# Altium schematic sheet TopSheet.SchDoc
size A2; SheetNumber: 1; SheetTotal: 16
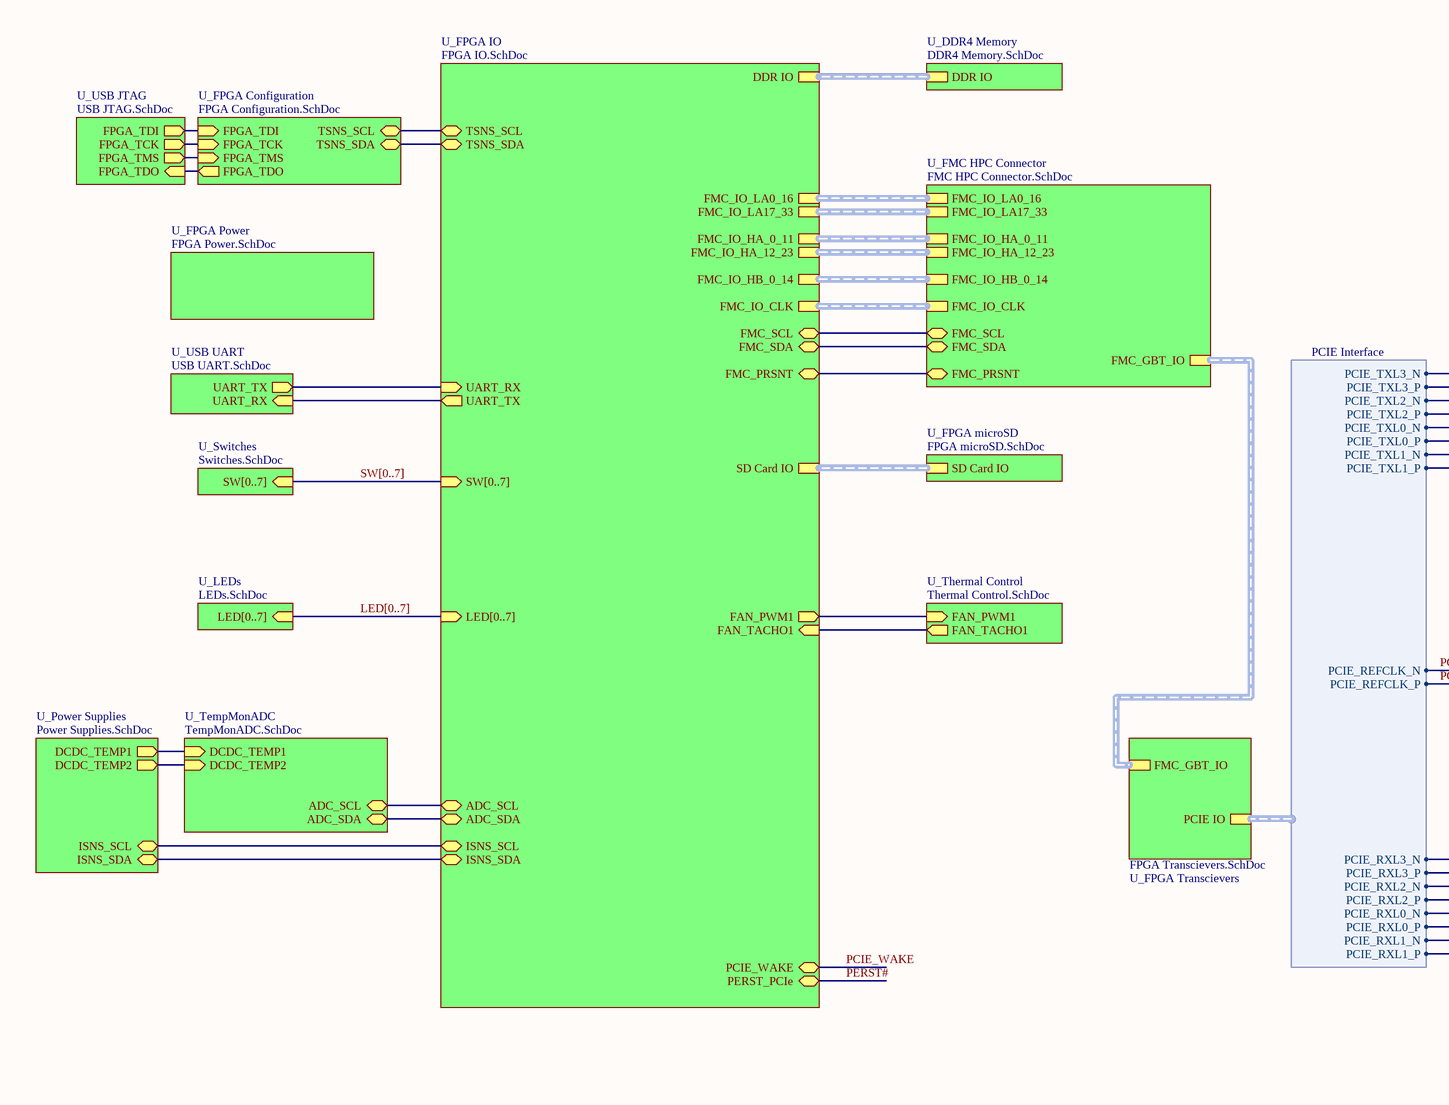
[diagram p0: TopSheet.SchDoc, left]
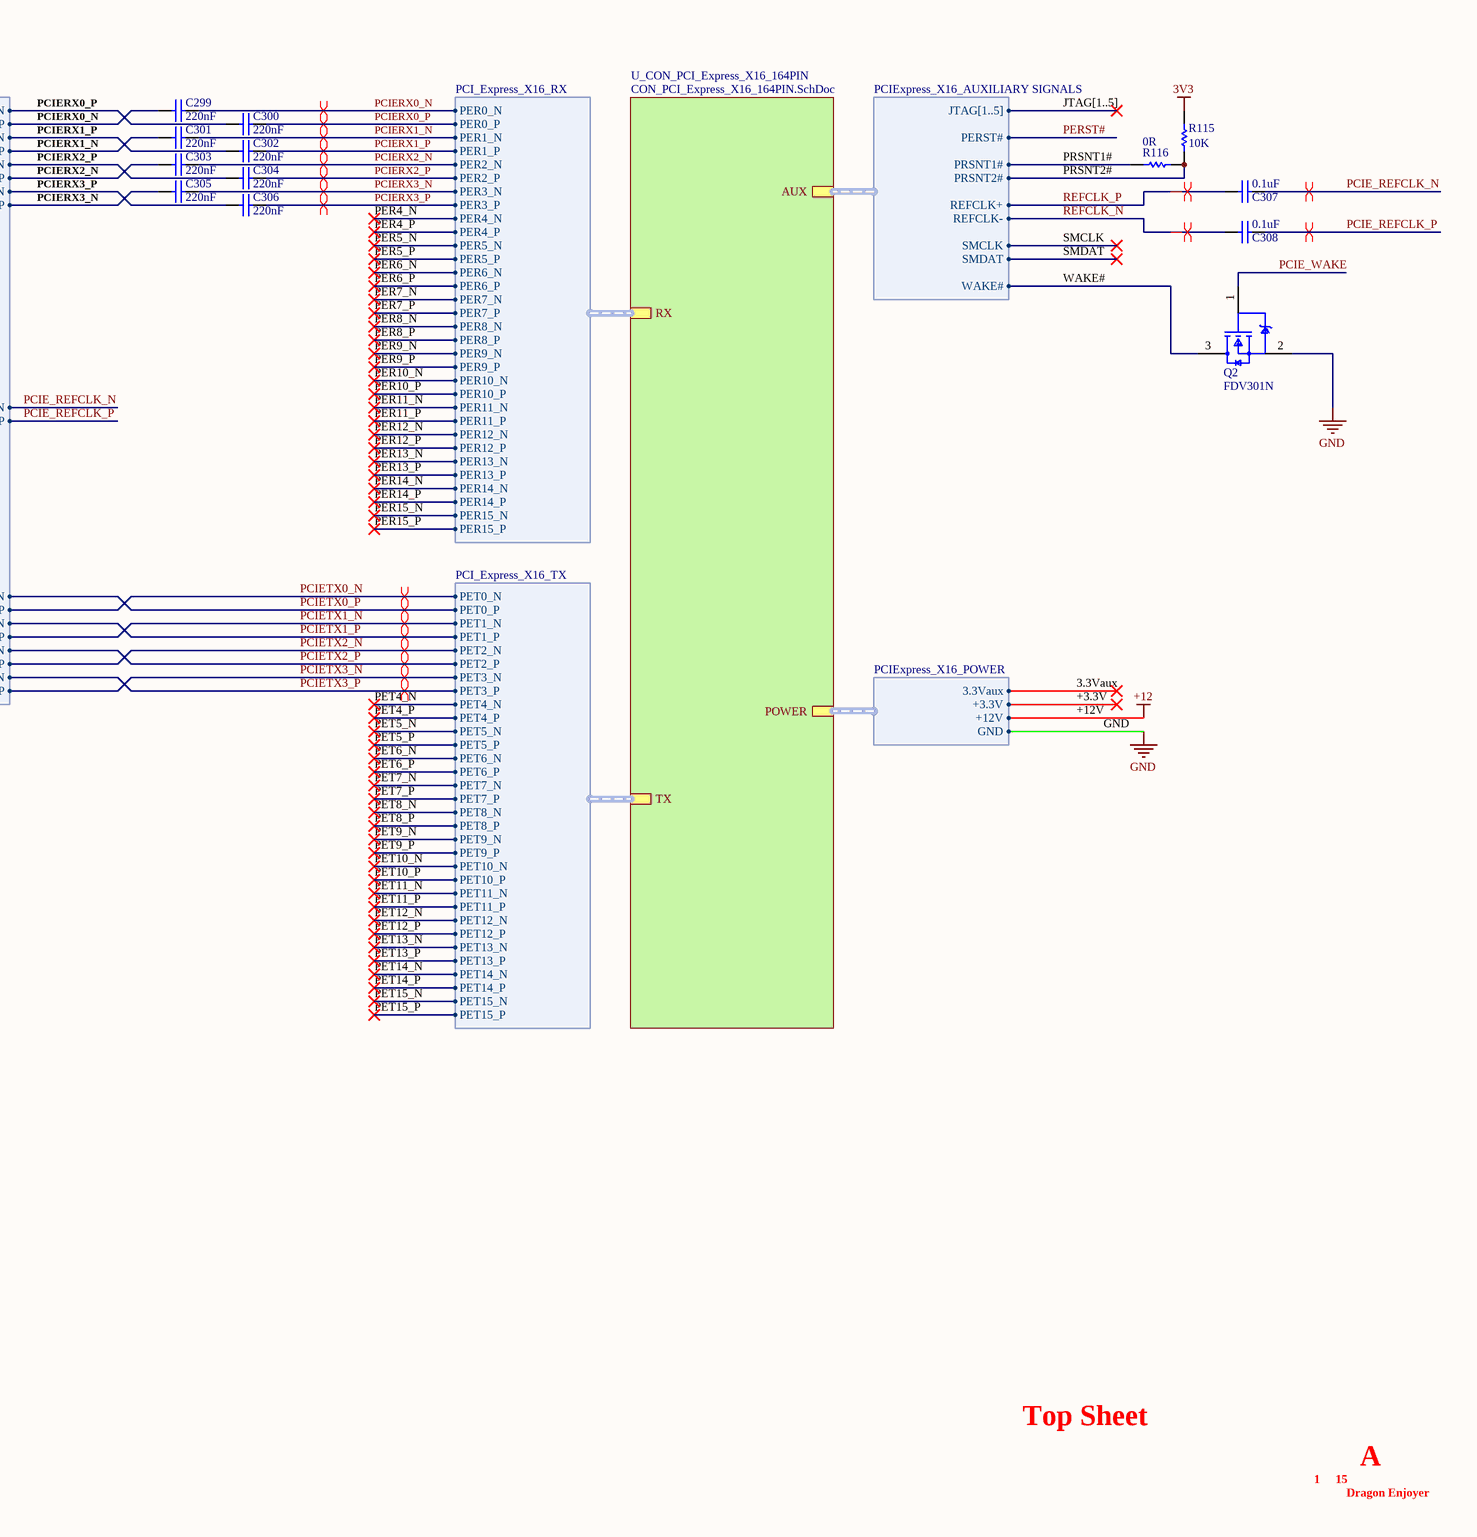
[diagram p1: TopSheet.SchDoc, right]

## Parts
C299  value 220nF  [CAPC1005X56X25LL10T15]  (hidden comment: 04026D224MAT2A)
C300  value 220nF  [CAPC1005X56X25LL10T15]  (hidden comment: 04026D224MAT2A)
C301  value 220nF  [CAPC1005X56X25LL10T15]  (hidden comment: 04026D224MAT2A)
C302  value 220nF  [CAPC1005X56X25LL10T15]  (hidden comment: 04026D224MAT2A)
C303  value 220nF  [CAPC1005X56X25LL10T15]  (hidden comment: 04026D224MAT2A)
C304  value 220nF  [CAPC1005X56X25LL10T15]  (hidden comment: 04026D224MAT2A)
C305  value 220nF  [CAPC1005X56X25LL10T15]  (hidden comment: 04026D224MAT2A)
C306  value 220nF  [CAPC1005X56X25LL10T15]  (hidden comment: 04026D224MAT2A)
C307  value 0.1uF  [CAPC1005X56X25LL10T15]  (hidden comment: 04026D104KAT2A)
C308  value 0.1uF  [CAPC1005X56X25LL10T15]  (hidden comment: 04026D104KAT2A)
Q2  FDV301N  [FP-318-08-MFG]
R115  value 10K  [RESC1609X50X30NL8T20]  (hidden comment: CRCW060310K0FKEA)
R116  value 0R  [RESC1005X40X25ML05T10]  (hidden comment: CRCW04020000Z0EDHP)

## Sub-sheets
U_CON_PCI_Express_X16_164PIN = CON_PCI_Express_X16_164PIN.SchDoc: POWER (harness PCIExpress_X16_POWER), AUX (harness PCIExpress_X16_AUXILIARY SIGNALS), TX (harness PCI_Express_X16_TX), RX (harness PCI_Express_X16_RX)
U_DDR4 Memory = DDR4 Memory.SchDoc: DDR IO (harness DDR IO)
U_FMC HPC Connector = FMC HPC Connector.SchDoc: FMC_GBT_IO (harness FMC_GBT_IO), FMC_IO_LA0_16 (harness FMC_IO_LA0_16), FMC_IO_LA17_33 (harness FMC_IO_LA17_33), FMC_IO_HA_0_11 (harness FMC_IO_HA_0_11), FMC_IO_HA_12_23 (harness FMC_IO_HA_12_23), FMC_SCL (bidir), FMC_SDA (bidir), FMC_PRSNT (bidir), FMC_IO_CLK (harness FMC_IO_CLK), FMC_IO_HB_0_14 (harness FMC_IO_HB_0_14)
U_FPGA Configuration = FPGA Configuration.SchDoc: FPGA_TDI (in), FPGA_TDO (out), FPGA_TCK (in), FPGA_TMS (in), TSNS_SCL (bidir), TSNS_SDA (bidir)
U_FPGA IO = FPGA IO.SchDoc: DDR IO (harness DDR IO), PERST_PCIe (bidir), ISNS_SCL (bidir), ISNS_SDA (bidir), TSNS_SCL (bidir), TSNS_SDA (bidir), FMC_IO_LA0_16 (harness FMC_IO_LA0_16), FMC_IO_LA17_33 (harness FMC_IO_LA17_33), FMC_IO_HA_0_11 (harness FMC_IO_HA_0_11), FMC_IO_HA_12_23 (harness FMC_IO_HA_12_23), FMC_IO_CLK (harness FMC_IO_CLK), UART_TX (out), UART_RX (in), FMC_SCL (bidir), FMC_SDA (bidir), FMC_IO_HB_0_14 (harness FMC_IO_HB_0_14), SD Card IO (harness SD Card IO), LED[0..7] (in), SW[0..7] (in), ADC_SDA (bidir), ADC_SCL (bidir), FMC_PRSNT (bidir), FAN_TACHO1 (in), FAN_PWM1 (out), PCIE_WAKE (bidir)
U_FPGA microSD = FPGA microSD.SchDoc: SD Card IO (harness SD Card IO)
U_FPGA Power = FPGA Power.SchDoc: no entries
U_FPGA Transcievers = FPGA Transcievers.SchDoc: PCIE IO (harness PCIE Interface), FMC_GBT_IO (harness FMC_GBT_IO)
U_LEDs = LEDs.SchDoc: LED[0..7] (in)
U_Power Supplies = Power Supplies.SchDoc: DCDC_TEMP1 (out), DCDC_TEMP2 (out), ISNS_SCL (bidir), ISNS_SDA (bidir)
U_Switches = Switches.SchDoc: SW[0..7] (in)
U_TempMonADC = TempMonADC.SchDoc: DCDC_TEMP1 (in), DCDC_TEMP2 (in), ADC_SDA (bidir), ADC_SCL (bidir)
U_Thermal Control = Thermal Control.SchDoc: FAN_TACHO1 (out), FAN_PWM1 (in)
U_USB JTAG = USB JTAG.SchDoc: FPGA_TDI (out), FPGA_TDO (in), FPGA_TCK (out), FPGA_TMS (out)
U_USB UART = USB UART.SchDoc: UART_TX (out), UART_RX (in)

## Harnesses
PCIE Interface: PCIE_REFCLK_N, PCIE_REFCLK_P, PCIE_RXL0_N, PCIE_RXL0_P, PCIE_RXL1_N, PCIE_RXL1_P, PCIE_RXL2_N, PCIE_RXL2_P, PCIE_RXL3_N, PCIE_RXL3_P, PCIE_TXL0_N, PCIE_TXL0_P, PCIE_TXL1_N, PCIE_TXL1_P, PCIE_TXL2_N, PCIE_TXL2_P, PCIE_TXL3_N, PCIE_TXL3_P
PCI_Express_X16_RX: PER0_N, PER0_P, PER1_N, PER1_P, PER2_N, PER2_P, PER3_N, PER3_P, PER4_N, PER4_P, PER5_N, PER5_P, PER6_N, PER6_P, PER7_N, PER7_P, PER8_N, PER8_P, PER9_N, PER9_P, PER10_N, PER10_P, PER11_N, PER11_P, PER12_N, PER12_P, PER13_N, PER13_P, PER14_N, PER14_P, PER15_N, PER15_P
PCI_Express_X16_TX: PET0_N, PET0_P, PET1_N, PET1_P, PET2_N, PET2_P, PET3_N, PET3_P, PET4_N, PET4_P, PET5_N, PET5_P, PET6_N, PET6_P, PET7_N, PET7_P, PET8_N, PET8_P, PET9_N, PET9_P, PET10_N, PET10_P, PET11_N, PET11_P, PET12_N, PET12_P, PET13_N, PET13_P, PET14_N, PET14_P, PET15_N, PET15_P
PCIExpress_X16_POWER: +3.3V, +12V, GND, 3.3Vaux
PCIExpress_X16_AUXILIARY SIGNALS: JTAG[1..5], PERST#, PRSNT1#, PRSNT2#, REFCLK+, REFCLK-, SMCLK, SMDAT, WAKE#

## Nets
3V3: R115.2
+12V: sheet U_CON_PCI_Express_X16_164PIN/POWER.+12V  [also labelled +12]
GND: Q2.2(S) ; sheet U_CON_PCI_Express_X16_164PIN/POWER.GND
3.3Vaux: sheet U_CON_PCI_Express_X16_164PIN/POWER.3.3Vaux
+3.3V: sheet U_CON_PCI_Express_X16_164PIN/POWER.+3.3V
PCIE_REFCLK_N: C307.2 ; sheet U_FPGA Transcievers/PCIE IO.PCIE_REFCLK_N
PCIE_REFCLK_P: C308.2 ; sheet U_FPGA Transcievers/PCIE IO.PCIE_REFCLK_P
PCIE_WAKE: Q2.1(G) ; sheet U_FPGA IO/PCIE_WAKE
PCIERX0_N: C299.2 ; sheet U_CON_PCI_Express_X16_164PIN/RX.PER0_N
PCIERX0_P: C300.2 ; sheet U_CON_PCI_Express_X16_164PIN/RX.PER0_P
PCIERX1_N: C301.2 ; sheet U_CON_PCI_Express_X16_164PIN/RX.PER1_N
PCIERX1_P: C302.2 ; sheet U_CON_PCI_Express_X16_164PIN/RX.PER1_P
PCIERX2_N: C303.2 ; sheet U_CON_PCI_Express_X16_164PIN/RX.PER2_N
PCIERX2_P: C304.2 ; sheet U_CON_PCI_Express_X16_164PIN/RX.PER2_P
PCIERX3_N: C305.2 ; sheet U_CON_PCI_Express_X16_164PIN/RX.PER3_N
PCIERX3_P: C306.2 ; sheet U_CON_PCI_Express_X16_164PIN/RX.PER3_P
PCIETX0_N: sheet U_FPGA Transcievers/PCIE IO.PCIE_RXL3_P, sheet U_CON_PCI_Express_X16_164PIN/TX.PET0_N
PCIETX0_P: sheet U_FPGA Transcievers/PCIE IO.PCIE_RXL3_N, sheet U_CON_PCI_Express_X16_164PIN/TX.PET0_P
PCIETX1_N: sheet U_FPGA Transcievers/PCIE IO.PCIE_RXL2_P, sheet U_CON_PCI_Express_X16_164PIN/TX.PET1_N
PCIETX1_P: sheet U_FPGA Transcievers/PCIE IO.PCIE_RXL2_N, sheet U_CON_PCI_Express_X16_164PIN/TX.PET1_P
PCIETX2_N: sheet U_FPGA Transcievers/PCIE IO.PCIE_RXL0_P, sheet U_CON_PCI_Express_X16_164PIN/TX.PET2_N
PCIETX2_P: sheet U_FPGA Transcievers/PCIE IO.PCIE_RXL0_N, sheet U_CON_PCI_Express_X16_164PIN/TX.PET2_P
PCIETX3_N: sheet U_FPGA Transcievers/PCIE IO.PCIE_RXL1_P, sheet U_CON_PCI_Express_X16_164PIN/TX.PET3_N
PCIETX3_P: sheet U_FPGA Transcievers/PCIE IO.PCIE_RXL1_N, sheet U_CON_PCI_Express_X16_164PIN/TX.PET3_P
PER4_N: sheet U_CON_PCI_Express_X16_164PIN/RX.PER4_N
PER4_P: sheet U_CON_PCI_Express_X16_164PIN/RX.PER4_P
PER5_N: sheet U_CON_PCI_Express_X16_164PIN/RX.PER5_N
PER5_P: sheet U_CON_PCI_Express_X16_164PIN/RX.PER5_P
PER6_N: sheet U_CON_PCI_Express_X16_164PIN/RX.PER6_N
PER6_P: sheet U_CON_PCI_Express_X16_164PIN/RX.PER6_P
PER7_N: sheet U_CON_PCI_Express_X16_164PIN/RX.PER7_N
PER7_P: sheet U_CON_PCI_Express_X16_164PIN/RX.PER7_P
PER8_N: sheet U_CON_PCI_Express_X16_164PIN/RX.PER8_N
PER8_P: sheet U_CON_PCI_Express_X16_164PIN/RX.PER8_P
PER9_N: sheet U_CON_PCI_Express_X16_164PIN/RX.PER9_N
PER9_P: sheet U_CON_PCI_Express_X16_164PIN/RX.PER9_P
PER10_N: sheet U_CON_PCI_Express_X16_164PIN/RX.PER10_N
PER10_P: sheet U_CON_PCI_Express_X16_164PIN/RX.PER10_P
PER11_N: sheet U_CON_PCI_Express_X16_164PIN/RX.PER11_N
PER11_P: sheet U_CON_PCI_Express_X16_164PIN/RX.PER11_P
PER12_N: sheet U_CON_PCI_Express_X16_164PIN/RX.PER12_N
PER12_P: sheet U_CON_PCI_Express_X16_164PIN/RX.PER12_P
PER13_N: sheet U_CON_PCI_Express_X16_164PIN/RX.PER13_N
PER13_P: sheet U_CON_PCI_Express_X16_164PIN/RX.PER13_P
PER14_N: sheet U_CON_PCI_Express_X16_164PIN/RX.PER14_N
PER14_P: sheet U_CON_PCI_Express_X16_164PIN/RX.PER14_P
PER15_N: sheet U_CON_PCI_Express_X16_164PIN/RX.PER15_N
PER15_P: sheet U_CON_PCI_Express_X16_164PIN/RX.PER15_P
PERST#: sheet U_FPGA IO/PERST_PCIe, sheet U_CON_PCI_Express_X16_164PIN/AUX.PERST#
PET4_N: sheet U_CON_PCI_Express_X16_164PIN/TX.PET4_N
PET4_P: sheet U_CON_PCI_Express_X16_164PIN/TX.PET4_P
PET5_N: sheet U_CON_PCI_Express_X16_164PIN/TX.PET5_N
PET5_P: sheet U_CON_PCI_Express_X16_164PIN/TX.PET5_P
PET6_N: sheet U_CON_PCI_Express_X16_164PIN/TX.PET6_N
PET6_P: sheet U_CON_PCI_Express_X16_164PIN/TX.PET6_P
PET7_N: sheet U_CON_PCI_Express_X16_164PIN/TX.PET7_N
PET7_P: sheet U_CON_PCI_Express_X16_164PIN/TX.PET7_P
PET8_N: sheet U_CON_PCI_Express_X16_164PIN/TX.PET8_N
PET8_P: sheet U_CON_PCI_Express_X16_164PIN/TX.PET8_P
PET9_N: sheet U_CON_PCI_Express_X16_164PIN/TX.PET9_N
PET9_P: sheet U_CON_PCI_Express_X16_164PIN/TX.PET9_P
PET10_N: sheet U_CON_PCI_Express_X16_164PIN/TX.PET10_N
PET10_P: sheet U_CON_PCI_Express_X16_164PIN/TX.PET10_P
PET11_N: sheet U_CON_PCI_Express_X16_164PIN/TX.PET11_N
PET11_P: sheet U_CON_PCI_Express_X16_164PIN/TX.PET11_P
PET12_N: sheet U_CON_PCI_Express_X16_164PIN/TX.PET12_N
PET12_P: sheet U_CON_PCI_Express_X16_164PIN/TX.PET12_P
PET13_N: sheet U_CON_PCI_Express_X16_164PIN/TX.PET13_N
PET13_P: sheet U_CON_PCI_Express_X16_164PIN/TX.PET13_P
PET14_N: sheet U_CON_PCI_Express_X16_164PIN/TX.PET14_N
PET14_P: sheet U_CON_PCI_Express_X16_164PIN/TX.PET14_P
PET15_N: sheet U_CON_PCI_Express_X16_164PIN/TX.PET15_N
PET15_P: sheet U_CON_PCI_Express_X16_164PIN/TX.PET15_P
PRSNT1#: R116.1 ; sheet U_CON_PCI_Express_X16_164PIN/AUX.PRSNT1#
PRSNT2#: R115.1 R116.2 ; sheet U_CON_PCI_Express_X16_164PIN/AUX.PRSNT2#
REFCLK_N: C308.1 ; sheet U_CON_PCI_Express_X16_164PIN/AUX.REFCLK-
REFCLK_P: C307.1 ; sheet U_CON_PCI_Express_X16_164PIN/AUX.REFCLK+
SMCLK: sheet U_CON_PCI_Express_X16_164PIN/AUX.SMCLK
SMDAT: sheet U_CON_PCI_Express_X16_164PIN/AUX.SMDAT
WAKE#: Q2.3(D) ; sheet U_CON_PCI_Express_X16_164PIN/AUX.WAKE#
NetC299_1: C299.1 ; sheet U_FPGA Transcievers/PCIE IO.PCIE_TXL3_P
NetC300_1: C300.1 ; sheet U_FPGA Transcievers/PCIE IO.PCIE_TXL3_N
NetC301_1: C301.1 ; sheet U_FPGA Transcievers/PCIE IO.PCIE_TXL2_P
NetC302_1: C302.1 ; sheet U_FPGA Transcievers/PCIE IO.PCIE_TXL2_N
NetC303_1: C303.1 ; sheet U_FPGA Transcievers/PCIE IO.PCIE_TXL0_P
NetC304_1: C304.1 ; sheet U_FPGA Transcievers/PCIE IO.PCIE_TXL0_N
NetC305_1: C305.1 ; sheet U_FPGA Transcievers/PCIE IO.PCIE_TXL1_P
NetC306_1: C306.1 ; sheet U_FPGA Transcievers/PCIE IO.PCIE_TXL1_N
(unnamed): sheet U_FMC HPC Connector/FMC_SCL, sheet U_FPGA IO/FMC_SCL
(unnamed): sheet U_FMC HPC Connector/FMC_SDA, sheet U_FPGA IO/FMC_SDA
(unnamed): sheet U_FMC HPC Connector/FMC_PRSNT, sheet U_FPGA IO/FMC_PRSNT
(unnamed): sheet U_FPGA Configuration/FPGA_TDI, sheet U_USB JTAG/FPGA_TDI
(unnamed): sheet U_FPGA Configuration/FPGA_TDO, sheet U_USB JTAG/FPGA_TDO
(unnamed): sheet U_FPGA Configuration/FPGA_TCK, sheet U_USB JTAG/FPGA_TCK
(unnamed): sheet U_FPGA Configuration/FPGA_TMS, sheet U_USB JTAG/FPGA_TMS
(unnamed): sheet U_FPGA Configuration/TSNS_SCL, sheet U_FPGA IO/TSNS_SCL
(unnamed): sheet U_FPGA Configuration/TSNS_SDA, sheet U_FPGA IO/TSNS_SDA
(unnamed): sheet U_FPGA IO/ISNS_SCL, sheet U_Power Supplies/ISNS_SCL
(unnamed): sheet U_FPGA IO/ISNS_SDA, sheet U_Power Supplies/ISNS_SDA
(unnamed): sheet U_FPGA IO/UART_TX, sheet U_USB UART/UART_RX
(unnamed): sheet U_FPGA IO/UART_RX, sheet U_USB UART/UART_TX
(unnamed): sheet U_FPGA IO/ADC_SDA, sheet U_TempMonADC/ADC_SDA
(unnamed): sheet U_FPGA IO/ADC_SCL, sheet U_TempMonADC/ADC_SCL
(unnamed): sheet U_FPGA IO/FAN_TACHO1, sheet U_Thermal Control/FAN_TACHO1
(unnamed): sheet U_FPGA IO/FAN_PWM1, sheet U_Thermal Control/FAN_PWM1
(unnamed): sheet U_Power Supplies/DCDC_TEMP1, sheet U_TempMonADC/DCDC_TEMP1
(unnamed): sheet U_Power Supplies/DCDC_TEMP2, sheet U_TempMonADC/DCDC_TEMP2

## Buses and harness runs
bus JTAG[1..5]
bus LED[0..7] = sheet U_FPGA IO/LED[0..7] = sheet U_LEDs/LED[0..7]
bus SW[0..7] = sheet U_FPGA IO/SW[0..7] = sheet U_Switches/SW[0..7]
harness sheet U_DDR4 Memory/DDR IO = sheet U_FPGA IO/DDR IO
harness sheet U_FMC HPC Connector/FMC_GBT_IO = sheet U_FPGA Transcievers/FMC_GBT_IO
harness sheet U_FMC HPC Connector/FMC_IO_CLK = sheet U_FPGA IO/FMC_IO_CLK
harness sheet U_FMC HPC Connector/FMC_IO_HA_0_11 = sheet U_FPGA IO/FMC_IO_HA_0_11
harness sheet U_FMC HPC Connector/FMC_IO_HA_12_23 = sheet U_FPGA IO/FMC_IO_HA_12_23
harness sheet U_FMC HPC Connector/FMC_IO_HB_0_14 = sheet U_FPGA IO/FMC_IO_HB_0_14
harness sheet U_FMC HPC Connector/FMC_IO_LA0_16 = sheet U_FPGA IO/FMC_IO_LA0_16
harness sheet U_FMC HPC Connector/FMC_IO_LA17_33 = sheet U_FPGA IO/FMC_IO_LA17_33
harness sheet U_FPGA IO/SD Card IO = sheet U_FPGA microSD/SD Card IO

## Layout directives
differential pair: PCIE_REFCLK_N, PCIE_REFCLK_P, PCIERX0_N, PCIERX0_P, PCIERX1_N, PCIERX1_P, PCIERX2_N, PCIERX2_P, PCIERX3_N, PCIERX3_P, PCIETX0_N, PCIETX0_P, PCIETX1_N, PCIETX1_P, PCIETX2_N, PCIETX2_P, PCIETX3_N, PCIETX3_P, REFCLK_N, REFCLK_P

## Notes on the sheet
- PCIERX0_N
- PCIERX0_P
- PCIERX1_N
- PCIERX1_P
- PCIERX2_N
- PCIERX2_P
- PCIERX3_N
- PCIERX3_P
- Top Sheet
- 1
- 15
- Dragon Enjoyer
- A

## Library data of the parts
C299-C306 = CMP-2008-02749-1: Manufacturer: AVX Interconnect / Elco; Part Number: 04026D224MAT2A
C307 C308 = CMP-2008-02743-1: Manufacturer: AVX Interconnect / Elco; Part Number: 04026D104KAT2A
Q2 = CMP-2000-04935-2: MOSFET N-CH 25V 220MA SOT-23; Manufacturer: ON Semiconductor; Turn Off Delay Time: 3.5ns; Typ Forward Diode Voltage: 0.8V; Max Junction Temp: +150°C; Threshold Vgs Max: 1.06V; Threshold Vgs Min: 0.7V; Standoff Height: 0.01mm; Max Forward Diode Voltage: 1.2V; Number Of Channels: 1; Rthja Max: 357°C/W; Drain To Source Resistance: 3.1Ω; Input Capacitace At Vds: 9.5pF @ 10V; Gate Charge At Vgs: 0.49nC @ 4.5V; Transconductance: 0.2S; Turn On Delay Time: 3.2ns; Depletion Mode: False; Power Dissipation: 0.35W; Continuous Drain Current: 0.22A; Gate To Source Voltage: 8V; RoHS: TRUE; Lead Free: Yes; Temperature Range High: +150°C; Automotive: No; Height: 1.11mm; Category: Trans; Mouser Description: MOSFET N-Ch Digital; Drain To Source Voltage: 25V; Temperature: -55°C to +150°C; Ipc Land Pattern Name: SOT95P240X100-3; Device Class L1: Discrete Semiconductors; Octopart: https://octopart.com/fdv301n-on+semiconductor-84326713; Footprint Url: https://www.onsemi.com/pub/Collateral/318-08.PDF; Digikey Description: MOSFET N-CH 25V 220MA SOT-23; Drain To Source Breakdown Voltage: 25V; Temperature Range Low: -55°C; Number Of N Channels: 1; Device Class L3: MOSFETs; Package: 318-08; ComponentLink2URL: https://www.onsemi.com/pub/Collateral/FDV301N-D.PDF; Manufacturer Part Number: FDV301N; Device Class L2: Transistors; ComponentLink2Description: Datasheet
R115 = CMP-1666-00005-4: Chip Resistor, 10 KOhm, +/- 1%, 100 mW, -55 to 155 degC, 0603 (1608 Metric), RoHS, Tape and Reel; Manufacturer: Vishay Semiconductor; Voltage Rating: 75 V; Max Operating Temperature: 155 degC; PackageDescription: 2-Pin Surface Mount Device, Body 1.575 x 0.85 mm; ComponentLink1Description: Manufacturer URL; RoHSCompliant: true; PackageReference: 0603; REACH SVHC: Unknown; Length: 1.55 mm; DatasheetVersion: 06/2012; Packaging: Tape and Reel; Min Operating Temperature: -55 degC; Mounting Technology: Surface Mount; ComponentLink2URL: https://datasheet.ciiva.com/11809/0900766b80d98afc-11809037.pdf; Height: 0.45 mm; ComponentLink2Description: Datasheet; Package Quantity: 5000; ComponentLink1URL: http://www.vishay.com/
R116 = CMP-2002-03041-1: Manufacturer: Vishay Dale; Part Number: CRCW04020000Z0EDHP